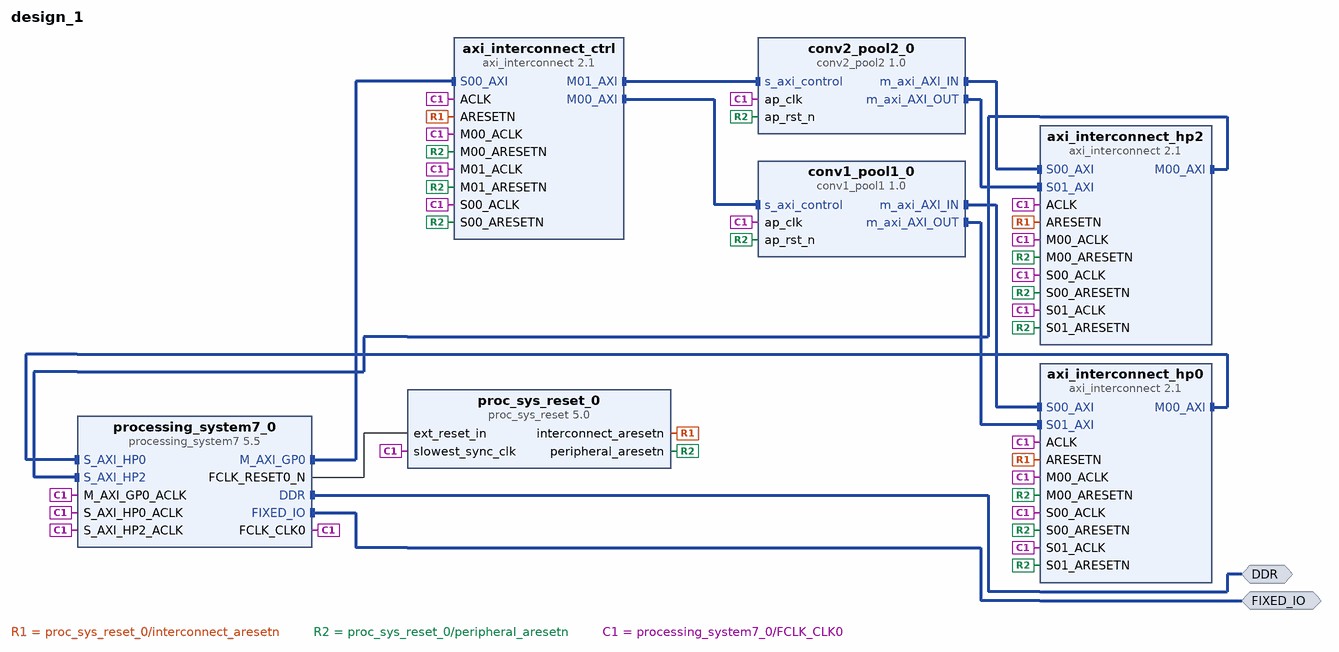
[diagram p0: block diagram of the top level]
# Vivado block design design_1, xc7z020clg400-1, Vivado 2024.2
create_bd_design design_1

create_bd_intf_port -mode Master -vlnv xilinx.com:interface:ddrx_rtl:1.0 DDR
create_bd_intf_port -mode Master -vlnv xilinx.com:display_processing_system7:fixedio_rtl:1.0 FIXED_IO

create_bd_cell -type ip -vlnv xilinx.com:ip:processing_system7:5.5 processing_system7_0
set_property -dict [list \
  CONFIG.PCW_FPGA0_PERIPHERAL_FREQMHZ 100 \
  CONFIG.PCW_USE_S_AXI_HP0 1 \
  CONFIG.PCW_USE_S_AXI_HP2 1 \
] [get_bd_cells processing_system7_0]
# 33 more settings of processing_system7_0 are not shown: defaults, MIO pin electricals, DDR timing, and values the tool derives
create_bd_cell -type ip -vlnv xilinx.com:ip:proc_sys_reset:5.0 proc_sys_reset_0
create_bd_cell -type ip -vlnv user:hls:conv1_pool1:1.0 conv1_pool1_0
create_bd_cell -type ip -vlnv user:hls:conv2_pool2:1.0 conv2_pool2_0
create_bd_cell -type ip -vlnv xilinx.com:ip:axi_interconnect:2.1 axi_interconnect_ctrl
set_property -dict {CONFIG.NUM_MI 2 CONFIG.NUM_SI 1} [get_bd_cells axi_interconnect_ctrl]
create_bd_cell -type ip -vlnv xilinx.com:ip:axi_interconnect:2.1 axi_interconnect_hp0
set_property -dict {CONFIG.NUM_MI 1 CONFIG.NUM_SI 2} [get_bd_cells axi_interconnect_hp0]
create_bd_cell -type ip -vlnv xilinx.com:ip:axi_interconnect:2.1 axi_interconnect_hp2
set_property -dict {CONFIG.NUM_MI 1 CONFIG.NUM_SI 2} [get_bd_cells axi_interconnect_hp2]

# ---- connections ----

connect_bd_intf_net [get_bd_intf_pins axi_interconnect_ctrl/M00_AXI] [get_bd_intf_pins conv1_pool1_0/s_axi_control]
connect_bd_intf_net [get_bd_intf_pins axi_interconnect_ctrl/M01_AXI] [get_bd_intf_pins conv2_pool2_0/s_axi_control]
connect_bd_intf_net [get_bd_intf_pins axi_interconnect_hp0/M00_AXI] [get_bd_intf_pins processing_system7_0/S_AXI_HP0]
connect_bd_intf_net [get_bd_intf_pins axi_interconnect_hp2/M00_AXI] [get_bd_intf_pins processing_system7_0/S_AXI_HP2]
connect_bd_intf_net [get_bd_intf_pins conv1_pool1_0/m_axi_AXI_IN] [get_bd_intf_pins axi_interconnect_hp0/S00_AXI]
connect_bd_intf_net [get_bd_intf_pins conv1_pool1_0/m_axi_AXI_OUT] [get_bd_intf_pins axi_interconnect_hp0/S01_AXI]
connect_bd_intf_net [get_bd_intf_pins conv2_pool2_0/m_axi_AXI_IN] [get_bd_intf_pins axi_interconnect_hp2/S00_AXI]
connect_bd_intf_net [get_bd_intf_pins conv2_pool2_0/m_axi_AXI_OUT] [get_bd_intf_pins axi_interconnect_hp2/S01_AXI]
connect_bd_intf_net [get_bd_intf_ports DDR] [get_bd_intf_pins processing_system7_0/DDR]
connect_bd_intf_net [get_bd_intf_ports FIXED_IO] [get_bd_intf_pins processing_system7_0/FIXED_IO]
connect_bd_intf_net [get_bd_intf_pins processing_system7_0/M_AXI_GP0] [get_bd_intf_pins axi_interconnect_ctrl/S00_AXI]
connect_bd_net [get_bd_pins proc_sys_reset_0/interconnect_aresetn] \
  [get_bd_pins axi_interconnect_ctrl/ARESETN] [get_bd_pins axi_interconnect_hp0/ARESETN] \
  [get_bd_pins axi_interconnect_hp2/ARESETN]
connect_bd_net [get_bd_pins proc_sys_reset_0/peripheral_aresetn] \
  [get_bd_pins axi_interconnect_ctrl/S00_ARESETN] [get_bd_pins axi_interconnect_ctrl/M00_ARESETN] \
  [get_bd_pins axi_interconnect_ctrl/M01_ARESETN] [get_bd_pins axi_interconnect_hp0/S00_ARESETN] \
  [get_bd_pins axi_interconnect_hp0/S01_ARESETN] [get_bd_pins axi_interconnect_hp0/M00_ARESETN] \
  [get_bd_pins axi_interconnect_hp2/S00_ARESETN] [get_bd_pins axi_interconnect_hp2/S01_ARESETN] \
  [get_bd_pins axi_interconnect_hp2/M00_ARESETN] [get_bd_pins conv1_pool1_0/ap_rst_n] [get_bd_pins conv2_pool2_0/ap_rst_n]
connect_bd_net [get_bd_pins processing_system7_0/FCLK_CLK0] \
  [get_bd_pins processing_system7_0/M_AXI_GP0_ACLK] [get_bd_pins processing_system7_0/S_AXI_HP0_ACLK] \
  [get_bd_pins processing_system7_0/S_AXI_HP2_ACLK] [get_bd_pins proc_sys_reset_0/slowest_sync_clk] \
  [get_bd_pins axi_interconnect_ctrl/ACLK] [get_bd_pins axi_interconnect_ctrl/S00_ACLK] \
  [get_bd_pins axi_interconnect_ctrl/M00_ACLK] [get_bd_pins axi_interconnect_ctrl/M01_ACLK] \
  [get_bd_pins axi_interconnect_hp0/ACLK] [get_bd_pins axi_interconnect_hp0/S00_ACLK] \
  [get_bd_pins axi_interconnect_hp0/S01_ACLK] [get_bd_pins axi_interconnect_hp0/M00_ACLK] \
  [get_bd_pins axi_interconnect_hp2/ACLK] [get_bd_pins axi_interconnect_hp2/S00_ACLK] \
  [get_bd_pins axi_interconnect_hp2/S01_ACLK] [get_bd_pins axi_interconnect_hp2/M00_ACLK] [get_bd_pins conv1_pool1_0/ap_clk] \
  [get_bd_pins conv2_pool2_0/ap_clk]
connect_bd_net [get_bd_pins processing_system7_0/FCLK_RESET0_N] [get_bd_pins proc_sys_reset_0/ext_reset_in]

# ---- address map ----
assign_bd_address -offset 0x0000000000000000 -range 512M -target_address_space [get_bd_addr_spaces conv1_pool1_0/Data_m_axi_AXI_IN] [get_bd_addr_segs processing_system7_0/S_AXI_HP0/HP0_DDR_LOWOCM]
assign_bd_address -offset 0x0000000000000000 -range 512M -target_address_space [get_bd_addr_spaces conv1_pool1_0/Data_m_axi_AXI_OUT] [get_bd_addr_segs processing_system7_0/S_AXI_HP0/HP0_DDR_LOWOCM]
assign_bd_address -offset 0x0000000000000000 -range 512M -target_address_space [get_bd_addr_spaces conv2_pool2_0/Data_m_axi_AXI_IN] [get_bd_addr_segs processing_system7_0/S_AXI_HP2/HP2_DDR_LOWOCM]
assign_bd_address -offset 0x0000000000000000 -range 512M -target_address_space [get_bd_addr_spaces conv2_pool2_0/Data_m_axi_AXI_OUT] [get_bd_addr_segs processing_system7_0/S_AXI_HP2/HP2_DDR_LOWOCM]
assign_bd_address -offset 0x40000000 -range 64K -target_address_space [get_bd_addr_spaces processing_system7_0/Data] [get_bd_addr_segs conv1_pool1_0/s_axi_control/Reg]
assign_bd_address -offset 0x40010000 -range 64K -target_address_space [get_bd_addr_spaces processing_system7_0/Data] [get_bd_addr_segs conv2_pool2_0/s_axi_control/Reg]

validate_bd_design
save_bd_design
